# EAGLE design lcdPCB_schematic (EAGLE 9.6.2)
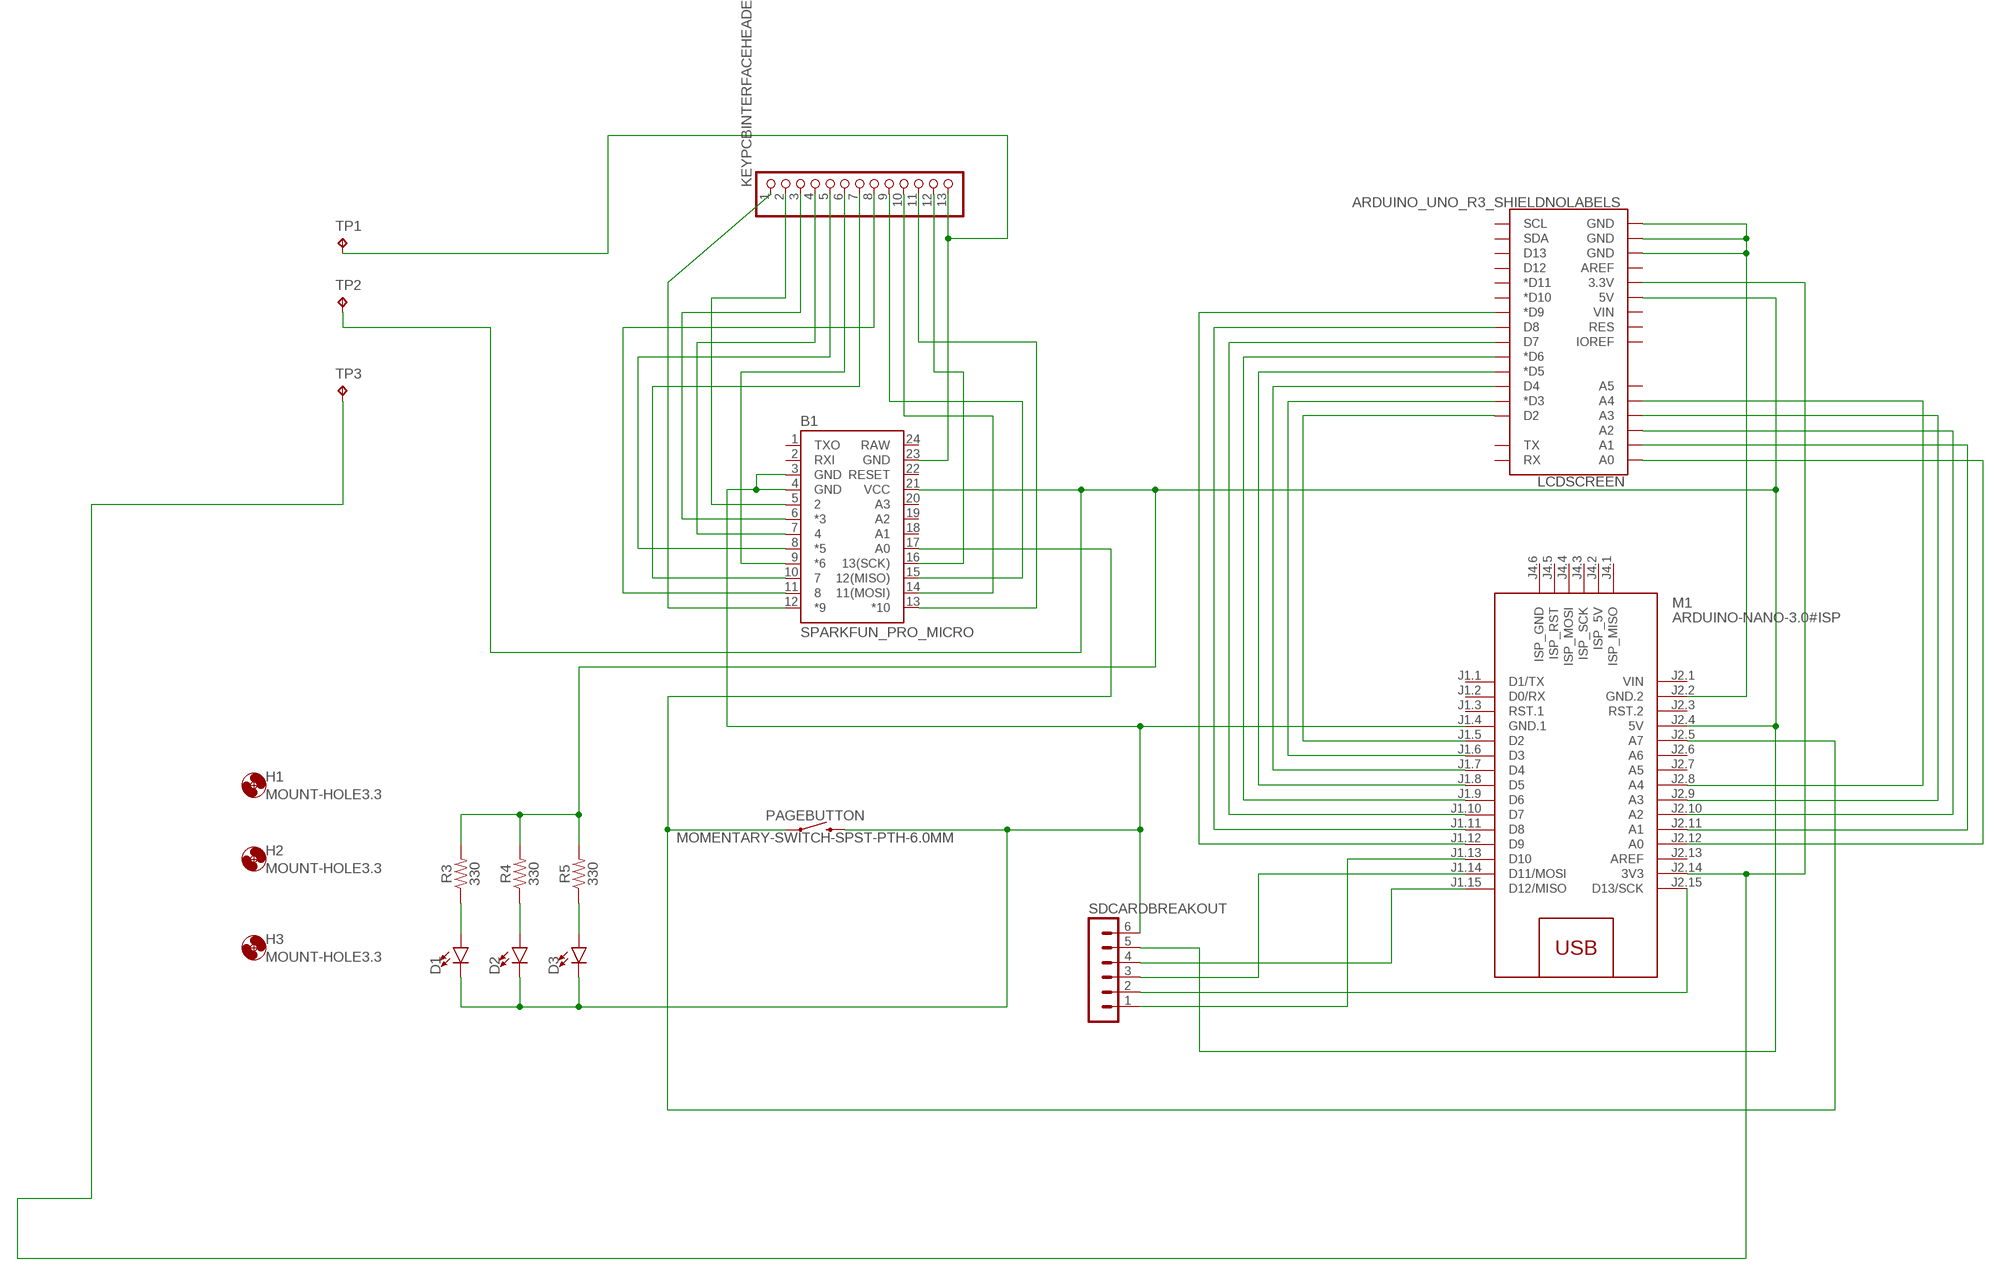
[diagram p0: schematic, sheet 1]

## Parts
B1  SPARKFUN_PRO_MICRO  [SPARKFUN_PRO_MICRO]
D1  LED-3MM-NO_SILK  [LED_3MM-NS]
D2  LED-3MM-NO_SILK  [LED_3MM-NS]
D3  LED-3MM-NO_SILK  [LED_3MM-NS]
H1  MOUNT-HOLE3.3  [3,3]
H2  MOUNT-HOLE3.3  [3,3]
H3  MOUNT-HOLE3.3  [3,3]
KEYPCBINTERFACEHEADER  PINHD-1X13  [1X13]
LCDSCREEN  ARDUINO_UNO_R3_SHIELDNOLABELS  [UNO_R3_SHIELD_NOLABELS]
M1  ARDUINO-NANO-3.0#ISP  [ARDUINO-NANO-3.0#ISP]
PAGEBUTTON  MOMENTARY-SWITCH-SPST-PTH-6.0MM  [TACTILE_SWITCH_PTH_6.0MM]
R3  330  330OHM-HORIZ-1/10W-5%  [AXIAL-0.3]
R4  330  330OHM-HORIZ-1/10W-5%  [AXIAL-0.3]
R5  330  330OHM-HORIZ-1/10W-5%  [AXIAL-0.3]
SDCARDBREAKOUT  MA06-1  [MA06-1]
TP1  TPTP20SQ  [TP20SQ]
TP2  TPTP20SQ  [TP20SQ]
TP3  TPTP20SQ  [TP20SQ]

## Nets
N$1: LCDSCREEN.A0 M1.J2.12(A0)
N$2: LCDSCREEN.A1 M1.J2.11(A1)
N$3: LCDSCREEN.A2 M1.J2.10(A2)
N$4: LCDSCREEN.A3 M1.J2.9(A3)
N$5: LCDSCREEN.A4 M1.J2.8(A4)
N$6: LCDSCREEN.D2 M1.J1.5(D2)
N$7: LCDSCREEN.D3(*D3) M1.J1.6(D3)
N$8: LCDSCREEN.D4 M1.J1.7(D4)
N$9: LCDSCREEN.D5(*D5) M1.J1.8(D5)
N$10: LCDSCREEN.D6(*D6) M1.J1.9(D6)
N$11: LCDSCREEN.D7 M1.J1.10(D7)
N$12: LCDSCREEN.D8 M1.J1.11(D8)
N$13: LCDSCREEN.D9(*D9) M1.J1.12(D9)
N$14: M1.J1.13(D10) SDCARDBREAKOUT.1
N$15: M1.J2.15(D13/SCK) SDCARDBREAKOUT.2
N$16: M1.J1.14(D11/MOSI) SDCARDBREAKOUT.3
N$17: M1.J1.15(D12/MISO) SDCARDBREAKOUT.4
N$18: B1.3(GND) B1.4(GND) D1.K(C) D2.K(C) D3.K(C) M1.J1.4(GND.1) PAGEBUTTON.3 SDCARDBREAKOUT.6
N$19: B1.21(VCC) LCDSCREEN.5V M1.J2.4(5V) R3.P$2 R4.P$2 R5.P$2 SDCARDBREAKOUT.5 TP2.TP
N$21: LCDSCREEN.3.3V M1.J2.14(3V3) TP3.TP
N$22: LCDSCREEN.GND@0(GND) LCDSCREEN.GND@1(GND) LCDSCREEN.GND@2(GND) M1.J2.2(GND.2)
N$23: B1.12(*9) KEYPCBINTERFACEHEADER.1
N$24: B1.5 KEYPCBINTERFACEHEADER.2
N$25: B1.6(*3) KEYPCBINTERFACEHEADER.3
N$26: B1.7 KEYPCBINTERFACEHEADER.4
N$27: B1.8(*5) KEYPCBINTERFACEHEADER.5
N$28: B1.9(*6) KEYPCBINTERFACEHEADER.6
N$29: B1.10 KEYPCBINTERFACEHEADER.7
N$30: B1.11 KEYPCBINTERFACEHEADER.8
N$31: B1.13(*10) KEYPCBINTERFACEHEADER.11
N$32: B1.15(12(MISO)) KEYPCBINTERFACEHEADER.9
N$33: B1.14(11(MOSI)) KEYPCBINTERFACEHEADER.10
N$34: B1.16(13(SCK)) KEYPCBINTERFACEHEADER.12
N$35: B1.17(A0) M1.J2.5(A7) PAGEBUTTON.1
N$36: B1.23(GND) KEYPCBINTERFACEHEADER.13 TP1.TP
N$38: D1.A R3.P$1
N$39: D2.A R4.P$1
N$40: D3.A R5.P$1
Unconnected: B1.1(TXO) B1.2(RXI) B1.18(A1) B1.19(A2) B1.20(A3) B1.22(RESET) LCDSCREEN.A5 LCDSCREEN.AREF LCDSCREEN.D10(*D10) LCDSCREEN.D11(*D11) LCDSCREEN.D12 LCDSCREEN.D13 LCDSCREEN.IOREF LCDSCREEN.RES LCDSCREEN.RX LCDSCREEN.SCL LCDSCREEN.SDA LCDSCREEN.TX LCDSCREEN.VIN M1.J1.1(D1/TX) M1.J1.2(D0/RX) M1.J1.3(RST.1) M1.J2.3(RST.2) M1.J2.6(A6) M1.J2.7(A5) M1.J2.13(AREF) M1.J4.1(ISP_MISO) M1.J4.2(ISP_5V) M1.J4.3(ISP_SCK) M1.J4.4(ISP_MOSI) M1.J4.5(ISP_RST) M1.J4.6(ISP_GND)

## Power pins joined to a net without a drawn wire
RAW: B1.24(RAW)
VIN: M1.J2.1(VIN)

## Library data of the parts
B1 = SparkFun-Boards:SPARKFUN_PRO_MICRO: SparkFun Pro Micro Atmega32U4 compatible footprint. SparkFun Products: 3.3V/8MHz <https://www.sparkfun.com/products/12587> 5V/16MHz <https://www.sparkfun.com/products/12640>
D1-D3 = SparkFun-LED:LED: LED (Generic) Standard schematic elements and footprints for 5mm, 3mm, 1206, and 0603 sized LEDs. Generic LEDs with no color specified.
H1-H3 = holes:MOUNT-HOLE: MOUNTING HOLE with drill center marker
KEYPCBINTERFACEHEADER = pinhead:PINHD-1X13: PIN HEADER
LCDSCREEN = SparkFun-BoardsEdit:ARDUINO_UNO_R3_SHIELD: Arduino R3 Shield Footprint Shield form compatible with the Arduino Uno R3. SparkFun Products: MG2639 Cellular Shield <https://www.sparkfun.com/products/13120> MIDI Shield <https://www.sparkfun.com/products/12898> R3 Stackable Headers Kit <https://www.sparkfun.com/products/11417>
M1 = diy-modules:ARDUINO-NANO-3.0#ISP: Arduino Nano 3.0 (and compatible devices) with ISP pads More details available here: https://www.arduino.cc/en/Main/ArduinoBoardNano Click here to find device on ebay.com <http://www.ebay.com/sch/arduino+nano>
PAGEBUTTON = SparkFun-Switches:MOMENTARY-SWITCH-SPST: Momentary Switch (Pushbutton) - SPST Normally-open (NO) SPST momentary switches (buttons, pushbuttons). Variants PTH-12MM - 12mm square, through-hole Momentary Pushbutton Switch - 12mm Square <https://www.sparkfun.com/products/9190> (COM-09190) PTH-6.0MM, PTH-6.0MM-KIT - 6.0mm square, through-hole Mini Pushbutton Switch <https://www.sparkfun.com/products/97> (COM-00097) KIT package intended for soldering kit's - only one side of pads' copper is exposed. PTH-RIGHT-ANGLE-KIT - Right-angle, through-hole Right Angle Tactile Button <https://www.sparkfun.com/products/10791> - Used on SparkFun BigTime Watch Kit <https://www.sparkfun.com/products/11734> SMD-12MM - 12mm square, surface-mount Tactile Button - SMD (12mm) <https://www.sparkfun.com/products/12993> (COM-12993) Used on SparkFun PicoBoard <https://www.sparkfun.com/products/11888> SMD-4.5MM - 4.5mm Square Trackball Switch Used on SparkFun Blackberry Trackballer Breakout <https://www.sparkfun.com/products/13169> SMD-4.6MMX2.8MM - 4.60mm x 2.80mm, surface mount Used on SparkFun SAMD21 Mini Breakout <https://www.sparkfun.com/products/13664> SMD-5.2MM, SMD-5.2-REDUNDANT - 5.2mm square, surface-mount Mini Pushbutton Switch - SMD <https://www.sparkfun.com/products/8720> (COM-08720) Used on Arduino Pro Mini <https://www.sparkfun.com/products/11114> REDUNDANT package connects both switch circuits together SMD-6.0X3.5MM - 6.0 x 3.5mm, surface mount Momentary Reset Switch SMD <https://www.sparkfun.com/products/8229> (COM-08229) SMD-6.2MM-TALL - 6.2mm square, surface mount Tactile Button - SMD (6mm) <https://www.sparkfun.com/products/12992> Used on SparkFun Digital Sandbox <https://www.sparkfun.com/products/12651> SMD-RIGHT-ANGLE - Right-angle, surface mount Used on SparkFun Block for Intel® Edison - Arduino <https://www.sparkfun.com/products/13036>; PROD_ID: SWCH-08441; SF_SKU: COM-00097
R3-R5 = SparkFun-Resistors:330OHM: 330Ω resistor A resistor is a passive two-terminal electrical component that implements electrical resistance as a circuit element. Resistors act to reduce current flow, and, at the same time, act to lower voltage levels within circuits. - Wikipedia; PROD_ID: RES-8371
SDCARDBREAKOUT = con-lstb:MA06-1: PIN HEADER; OC_FARNELL: unknown; OC_NEWARK: unknown
TP1-TP3 = testpad:TP: Test pad

## Board
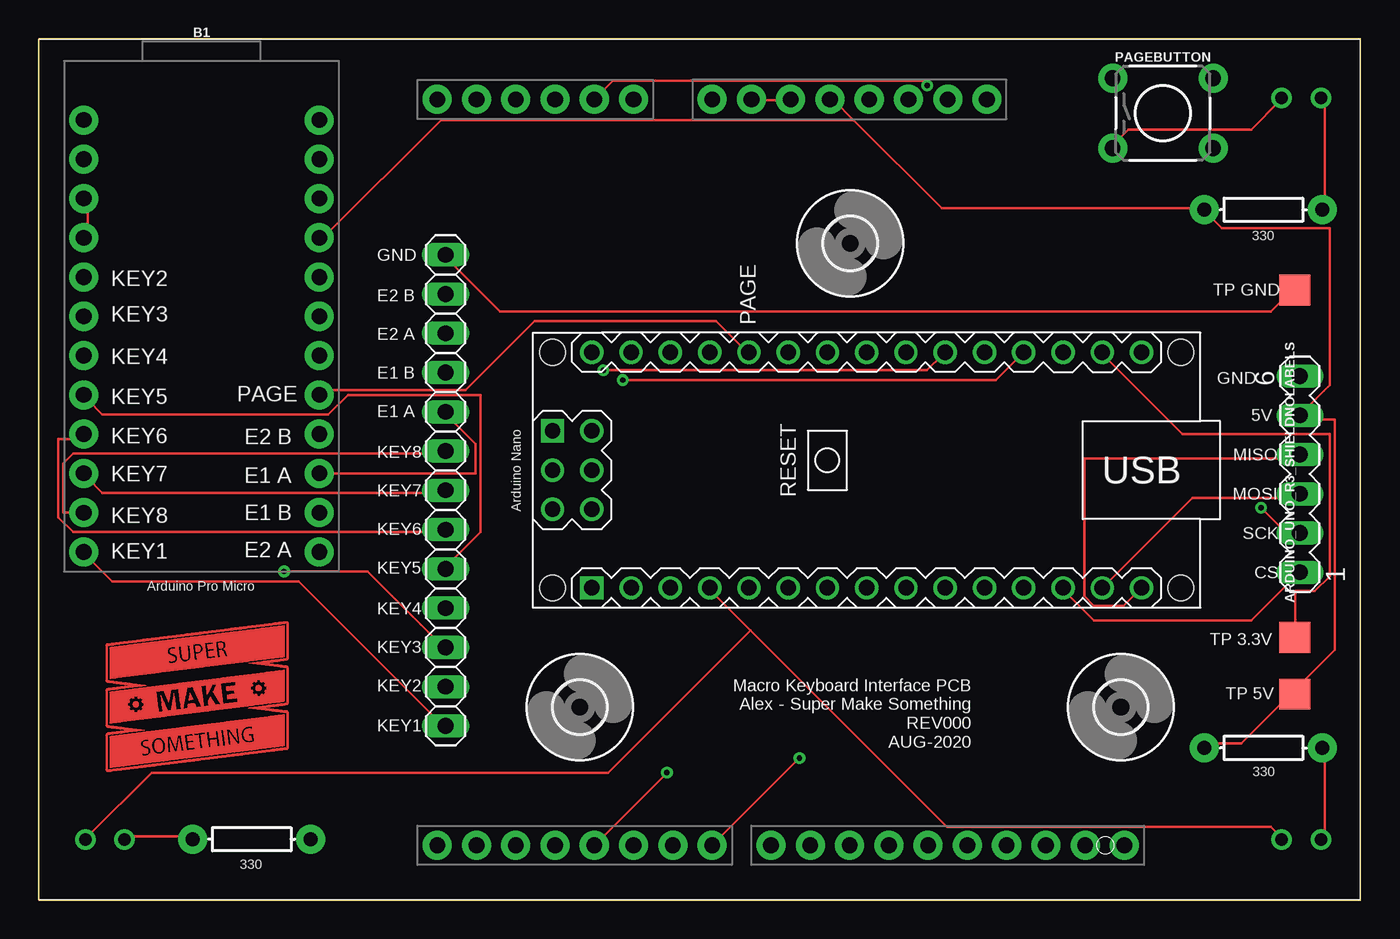
[diagram p1: board, top side]
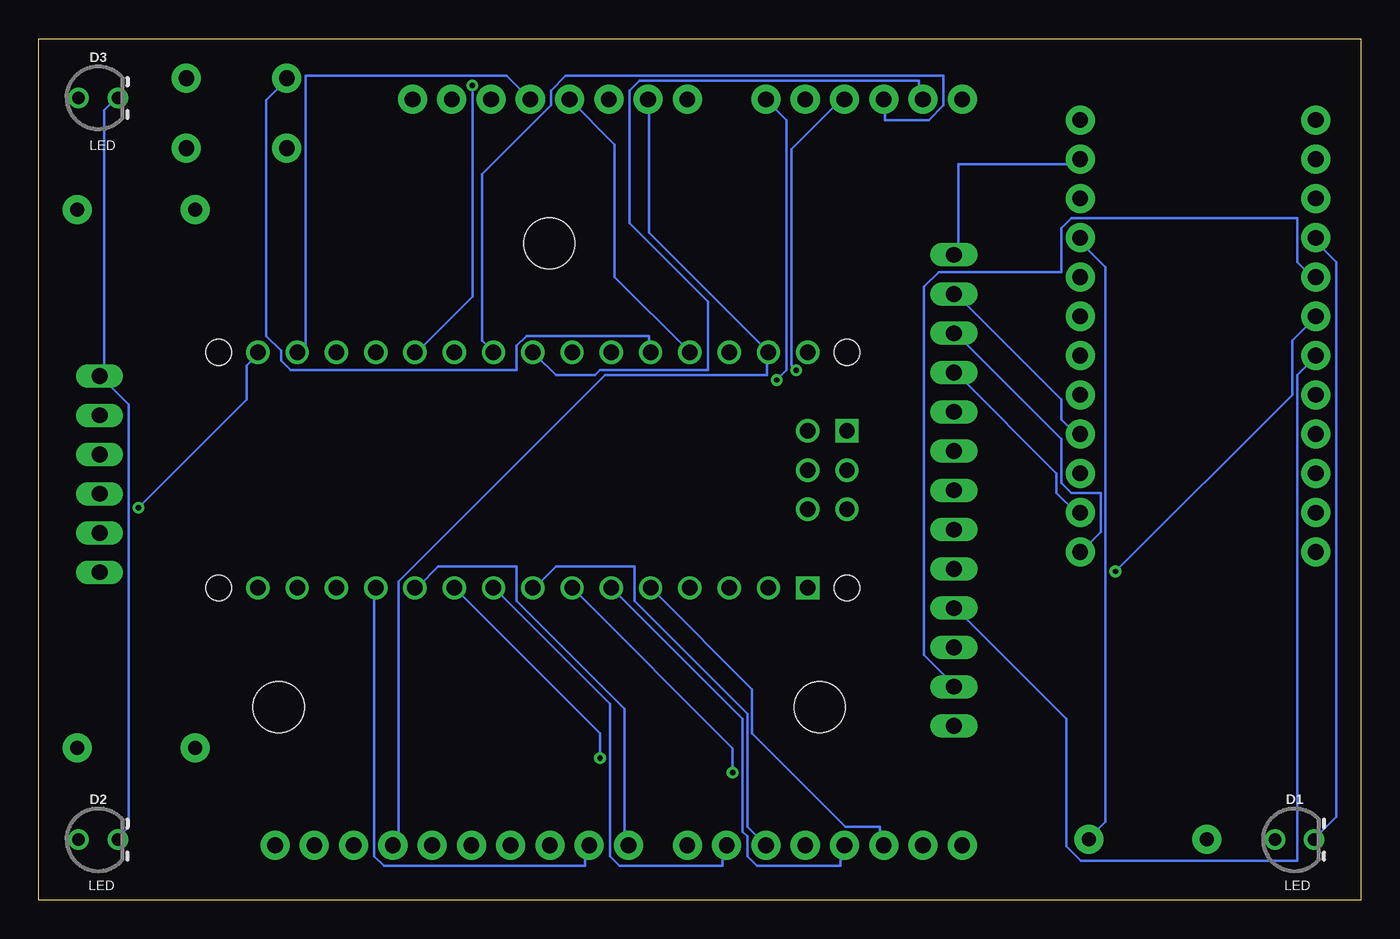
[diagram p2: board, bottom side, seen from below]

Size 85.52 x 55.74 mm. Coordinates in mm from the lower left corner, seen from the top.
Outline: 0,0 85.52,0 85.52,55.74 0,55.74 0,0
Copper layers (1*16): Top 0.035mm / dielectric 1.5mm / Bottom 0.035mm
Design rules "default": minimum track width 6mil, minimum drill 0.35mm, track to track 6mil, track to pad 6mil, pad to pad 6mil, via to via 6mil, smd to smd 6mil, copper to edge 40mil, drill to drill 6mil, minimum pad ring 10mil, minimum via ring 8mil, stop-mask expansion 4mil, vias tented up to drill 0mil, thermal gap 10mil

### Footprints (pad centres in the part's own frame; a part is rotated, then mirrored left to right if it is on the bottom)
SPARKFUN_PRO_MICRO = drill 1.016 pad 1.88: 1 -7.62,12.7; 2 -7.62,10.16; 3 -7.62,7.62; 4 -7.62,5.08; 5 -7.62,2.54; 6 -7.62,0; 7 -7.62,-2.54; 8 -7.62,-5.08; 9 -7.62,-7.62; 10 -7.62,-10.16; 11 -7.62,-12.7; 12 -7.62,-15.24; 13 7.62,-15.24; 14 7.62,-12.7; 15 7.62,-10.16; 16 7.62,-7.62; 17 7.62,-5.08; 18 7.62,-2.54; 19 7.62,0; 20 7.62,2.54; 21 7.62,5.08; 22 7.62,7.62; 23 7.62,10.16; 24 7.62,12.7
LED_3MM-NS = drill 0.813: A -1.27,0; K 1.27,0
3,3 = hole 3.3: 0,0
1X13 = drill 1.016 long: 1 -15.24,0; 2 -12.7,0; 3 -10.16,0; 4 -7.62,0; 5 -5.08,0; 6 -2.54,0; 7 0,0; 8 2.54,0; 9 5.08,0; 10 7.62,0; 11 10.16,0; 12 12.7,0; 13 15.24,0
UNO_R3_SHIELD_NOLABELS = drill 1.016 pad 1.88: 3.3V 24.13,-3.81; 5V 24.13,-1.27; A0 24.13,11.43; A1 24.13,13.97; A2 24.13,16.51; A3 24.13,19.05; A4 24.13,21.59; A5 24.13,24.13; AREF -24.13,-15.24; D2 -24.13,19.05; D3 -24.13,16.51; D4 -24.13,13.97; D5 -24.13,11.43; D6 -24.13,8.89; D7 -24.13,6.35; D8 -24.13,2.54; D9 -24.13,0; D10 -24.13,-2.54; D11 -24.13,-5.08; D12 -24.13,-7.62; D13 -24.13,-10.16; GND@0 24.13,1.27; GND@1 24.13,3.81; GND@2 -24.13,-12.7; IOREF 24.13,-8.89; NC 24.13,-11.43; RES 24.13,-6.35; RX -24.13,24.13; SCL -24.13,-20.32; SDA -24.13,-17.78; TX -24.13,21.59; VIN 24.13,6.35
ARDUINO-NANO-3.0#ISP = drill 1 square: J1.1 17.78,7.62; J4.1 20.32,-2.54 | drill 1: J1.2 15.24,7.62; J1.3 12.7,7.62; J1.4 10.16,7.62; J1.5 7.62,7.62; J1.6 5.08,7.62; J1.7 2.54,7.62; J1.8 0,7.62; J1.9 -2.54,7.62; J1.10 -5.08,7.62; J1.11 -7.62,7.62; J1.12 -10.16,7.62; J1.13 -12.7,7.62; J1.14 -15.24,7.62; J1.15 -17.78,7.62; J2.1 17.78,-7.62; J2.2 15.24,-7.62; J2.3 12.7,-7.62; J2.4 10.16,-7.62; J2.5 7.62,-7.62; J2.6 5.08,-7.62; J2.7 2.54,-7.62; J2.8 0,-7.62; J2.9 -2.54,-7.62; J2.10 -5.08,-7.62; J2.11 -7.62,-7.62; J2.12 -10.16,-7.62; J2.13 -12.7,-7.62; J2.14 -15.24,-7.62; J2.15 -17.78,-7.62; J4.2 17.78,-2.54; J4.3 20.32,0; J4.4 17.78,0; J4.5 20.32,2.54; J4.6 17.78,2.54 | hole 1.651: -20.32,7.62; -20.32,-7.62; 20.32,-7.62; 20.32,7.62
TACTILE_SWITCH_PTH_6.0MM = drill 1.016 pad 1.88: 1 -3.251,2.261; 2 3.251,2.261; 3 -3.251,-2.261; 4 3.251,-2.261
AXIAL-0.3 = drill 0.9 pad 1.88: P$1 -3.81,0; P$2 3.81,0
MA06-1 = drill 1.016 long: 1 -6.35,0; 2 -3.81,0; 3 -1.27,0; 4 1.27,0; 5 3.81,0; 6 6.35,0
TP20SQ = smd 2 x 2: TP 0,0

### Placement (x,y rotation side)
B1  10.53,37.78 0 top
D1  4.29,3.92 0 bottom
D2  81.67,3.92 0 bottom
D3  81.67,51.92 0 bottom
H1  35,12.5 0 top
H2  70,12.5 0 top
H3  52.5,42.5 0 top
KEYPCBINTERFACEHEADER  26.32,26.52 90 top
LCDSCREEN  49.91,27.69 90 top
M1  53.56,27.83 180 top
PAGEBUTTON  72.72,50.92 0 top
R3  13.78,3.95 0 top
R4  79.22,9.86 180 top
R5  79.22,44.67 180 top
SDCARDBREAKOUT  81.58,27.57 90 top
TP1  81.24,39.48 0 top
TP2  81.24,13.34 0 top
TP3  81.24,17 0 top

### Tracks (layer width: path | path; a pad name or v marks a point on that pad's centre or on a via)
N$1  (via drill 0.35)
  Top 0.152: v37.78,33.66 61.91,33.66 63.5,35.24 M1.J2.12
  Bottom 0.152: v37.78,33.66 37.15,34.29 37.15,50.48 LCDSCREEN.A0
N$2  (via drill 0.35)
  Top 0.152: v57.47,52.7 57.15,53.02 37.15,53.02 LCDSCREEN.A1
  Bottom 0.152: v57.47,52.7 57.47,39.05 60.96,35.56 M1.J2.11
N$3  (via drill 0.35)
  Top 0.152: v36.51,34.29 57.47,34.29 58.42,35.24 M1.J2.10
  Bottom 0.152: v36.51,34.29 36.83,34.61 36.83,48.58 33.66,51.75 LCDSCREEN.A2
N$4
  Bottom 0.152: M1.J2.9 56.2,35.56 56.83,36.2 56.83,46.99 52.39,51.44 52.39,52.39 51.44,53.34 26.99,53.34 26.99,51.44 27.94,50.48 30.8,50.48 30.8,51.75 LCDSCREEN.A3
N$5
  Bottom 0.152: M1.J2.8 53.34,35.24 52.07,33.97 49.53,33.97 49.21,34.29 42.23,34.29 42.23,38.73 47.31,43.81 47.31,52.39 46.67,53.02 28.57,53.02 28.57,52.07 LCDSCREEN.A4
N$6
  Bottom 0.152: M1.J1.5 45.72,20 39.37,13.65 39.37,10.79 33.34,4.76 31.11,4.76 31.11,3.81 LCDSCREEN.D2
N$7
  Bottom 0.152: M1.J1.6 48.26,20 40.01,11.75 40.01,4.45 39.69,4.13 39.69,2.86 39.05,2.22 33.66,2.22 33.66,3.49 LCDSCREEN.D3
N$8  (via drill 0.35)
  Top 0.152: LCDSCREEN.D4 v40.64,8.26
  Bottom 0.152: v40.64,8.26 40.64,9.84 50.8,20 M1.J1.7
N$9
  Bottom 0.152: LCDSCREEN.D5 39.69,4.76 39.69,12.06 46.99,19.37 46.99,21.59 52.07,21.59 53.34,20.32 M1.J1.8
N$10
  Bottom 0.152: M1.J1.9 55.88,20 48.58,12.7 48.58,2.86 47.94,2.22 41.27,2.22 41.27,3.49 LCDSCREEN.D6
N$11  (via drill 0.35)
  Top 0.152: LCDSCREEN.D7 v49.21,9.21
  Bottom 0.152: v49.21,9.21 49.21,10.79 58.42,20 M1.J1.10
N$12
  Bottom 0.152: M1.J1.11 60.96,20.32 59.69,21.59 54.61,21.59 54.61,19.37 47.62,12.38 47.62,3.81 LCDSCREEN.D8
N$13
  Bottom 0.152: M1.J1.12 63.82,20 63.82,2.86 63.18,2.22 50.16,2.22 50.16,3.49 LCDSCREEN.D9
N$14
  Top 0.152: M1.J1.13 66.36,20 68.26,18.1 78.42,18.1 81.28,20.95 SDCARDBREAKOUT.1
N$15  (via drill 0.35)
  Top 0.152: v79.06,25.4 80.64,23.81 81.28,23.81 SDCARDBREAKOUT.2
  Bottom 0.152: v79.06,25.4 72.07,32.38 72.07,34.61 71.44,35.24 M1.J2.15
N$16
  Top 0.152: M1.J1.14 68.9,20.32 74.61,26.04 81.28,26.04 SDCARDBREAKOUT.3
N$17
  Top 0.152: M1.J1.15 71.12,20 70.17,19.05 68.26,19.05 67.63,19.68 67.63,28.57 81.28,28.57 SDCARDBREAKOUT.4
N$18
  Top 0.152: B1.3 3.17,45.09 3.17,42.86 B1.4 | D3.K 80.33,51.75 78.42,49.85 70.48,49.85 69.53,48.9 PAGEBUTTON.3 | 46.04,17.46 58.74,4.76 79.69,4.76 80.33,4.13 D2.K | 46.04,17.46 43.5,20 M1.J1.4 | 46.04,17.46 36.83,8.26 7.3,8.26 3.17,4.13 D1.K
  Bottom 0.152: D1.K 2.86,4.13 1.59,5.4 1.59,41.27 2.86,42.55 B1.4 | D2.K 80.33,4.13 79.69,4.76 79.69,32.07 81.28,33.66 SDCARDBREAKOUT.6 81.28,33.97 81.28,51.12 80.64,51.75 D3.K
N$19
  Top 0.152: R4.P$2 75.56,10.16 77.79,10.16 80.96,13.34 TP2.TP 81.28,13.65 83.82,16.19 83.82,31.11 81.6,31.11 SDCARDBREAKOUT.5 81.6,31.43 83.5,33.34 83.5,43.5 76.52,43.5 75.56,44.45 R5.P$2 75.25,44.77 58.42,44.77 52.7,50.48 | 52.7,50.48 51.44,51.75 LCDSCREEN.5V | 52.7,50.48 26.04,50.48 18.41,42.86 B1.21
  Bottom 0.152: R3.P$2 17.46,4.13 16.51,5.08 16.51,40.96 18.1,42.55 B1.21 | LCDSCREEN.5V 48.26,48.9 48.26,40.32 43.5,35.56 M1.J2.4
N$21
  Top 0.152: TP3.TP 81.28,17.14 81.28,20 82.55,20 83.5,20.95 83.5,30.16 73.98,30.16 68.9,35.24 M1.J2.14
  Bottom 0.152: LCDSCREEN.3.3V 55.24,53.34 68.26,53.34 68.26,35.88 68.58,35.56 M1.J2.14
N$22
  Top 0.152: LCDSCREEN.GND@0 48.58,51.75 46.35,51.75 LCDSCREEN.GND@1
  Bottom 0.152: LCDSCREEN.GND@1 46.04,51.75 46.04,43.18 38.42,35.56 M1.J2.2 38.42,35.24 38.42,33.97 48.9,33.97 62.23,20.64 62.23,4.13 62.55,3.81 LCDSCREEN.GND@2
N$23
  Top 0.152: KEYPCBINTERFACEHEADER.1 26.04,11.43 16.83,20.64 4.76,20.64 3.17,22.23 B1.12
N$24
  Bottom 0.152: KEYPCBINTERFACEHEADER.2 26.35,13.97 28.26,15.88 28.26,39.69 27.3,40.64 19.37,40.64 19.37,43.5 18.73,44.13 4.13,44.13 4.13,41.27 3.17,40.32 B1.5
N$25  (via drill 0.35)
  Top 0.152: v15.88,21.27 21.27,21.27 26.04,16.51 KEYPCBINTERFACEHEADER.3
  Bottom 0.152: v15.88,21.27 4.45,32.7 4.45,36.2 3.17,37.47 B1.6
N$26
  Bottom 0.152: KEYPCBINTERFACEHEADER.4 26.04,18.73 19.05,11.75 19.05,3.49 18.1,2.54 4.13,2.54 4.13,33.97 3.17,34.92 B1.7
N$27
  Top 0.152: KEYPCBINTERFACEHEADER.5 26.35,21.59 28.57,23.81 28.57,32.7 20,32.7 18.73,31.43 4.13,31.43 3.17,32.38 B1.8
N$28
  Top 0.152: KEYPCBINTERFACEHEADER.6 26.04,23.81 2.22,23.81 1.27,24.77 1.27,29.84 2.86,29.84 B1.9
N$29
  Top 0.152: KEYPCBINTERFACEHEADER.7 26.04,26.35 4.13,26.35 3.17,27.3 B1.10
N$30
  Top 0.152: KEYPCBINTERFACEHEADER.8 26.04,28.89 2.22,28.89 1.59,28.26 1.59,25.08 2.86,25.08 B1.11
N$31
  Bottom 0.152: KEYPCBINTERFACEHEADER.11 26.04,36.51 19.37,29.84 19.37,26.99 18.73,26.35 16.83,26.35 16.83,23.81 18.1,22.54 B1.13
N$32
  Top 0.152: KEYPCBINTERFACEHEADER.9 26.35,31.43 28.26,29.53 28.26,27.62 18.41,27.62 B1.15
N$33
  Bottom 0.152: KEYPCBINTERFACEHEADER.10 26.04,33.97 19.68,27.62 19.68,26.35 18.41,25.08 B1.14
N$34
  Bottom 0.152: KEYPCBINTERFACEHEADER.12 26.04,39.05 19.37,32.38 19.37,31.11 18.41,30.16 B1.16
N$35
  Top 0.152: M1.J2.5 45.72,35.56 43.81,37.47 32.07,37.47 27.62,33.02 18.73,33.02 18.41,32.7 B1.17
  Bottom 0.152: PAGEBUTTON.1 69.53,53.02 70.8,51.75 70.8,36.51 69.85,35.56 69.85,34.92 69.22,34.29 54.61,34.29 54.61,35.88 53.98,36.51 46.04,36.51 46.04,35.56 M1.J2.5
N$36
  Top 0.152: TP1.TP 80.96,39.37 79.69,38.1 29.84,38.1 26.35,41.59 KEYPCBINTERFACEHEADER.13
  Bottom 0.152: B1.23 18.41,47.62 26.04,47.62 26.04,41.91 KEYPCBINTERFACEHEADER.13
N$38
  Top 0.152: D1.A 5.71,4.13 9.84,4.13 R3.P$1
N$39
  Top 0.152: D2.A 83.19,4.13 83.19,9.84 R4.P$1
N$40
  Top 0.152: D3.A 83.19,51.75 83.19,44.77 R5.P$1
(copper drawn outside any net)
  shapes: Top area x3961

### Text on the board
tPlace: 330 | GND | KEY2 | E2 B | TP GND | KEY3 | PAGE | E2 A | KEY4 | E1 B | GND | KEY5 | PAGE | E1 A | 5V | KEY6 | Arduino Nano | E2 B | KEY8 | MISO | KEY7 | E1 A | KEY7 | MOSI | E1 B | KEY8 | KEY6 | SCK | KEY1 | E2 A | KEY5 | CS | Arduino Pro Micro | KEY4 | TP 3.3V | KEY3 | KEY2 | Macro Keyboard Interface PCB / Alex - Super Make Something / REV000 / AUG-2020 | TP 5V | KEY1 | 330 | 330
bPlace: LED | LED | LED